# Altium schematic sheet 温控风扇原理图.SchDoc: 温控风扇原理图
size A4
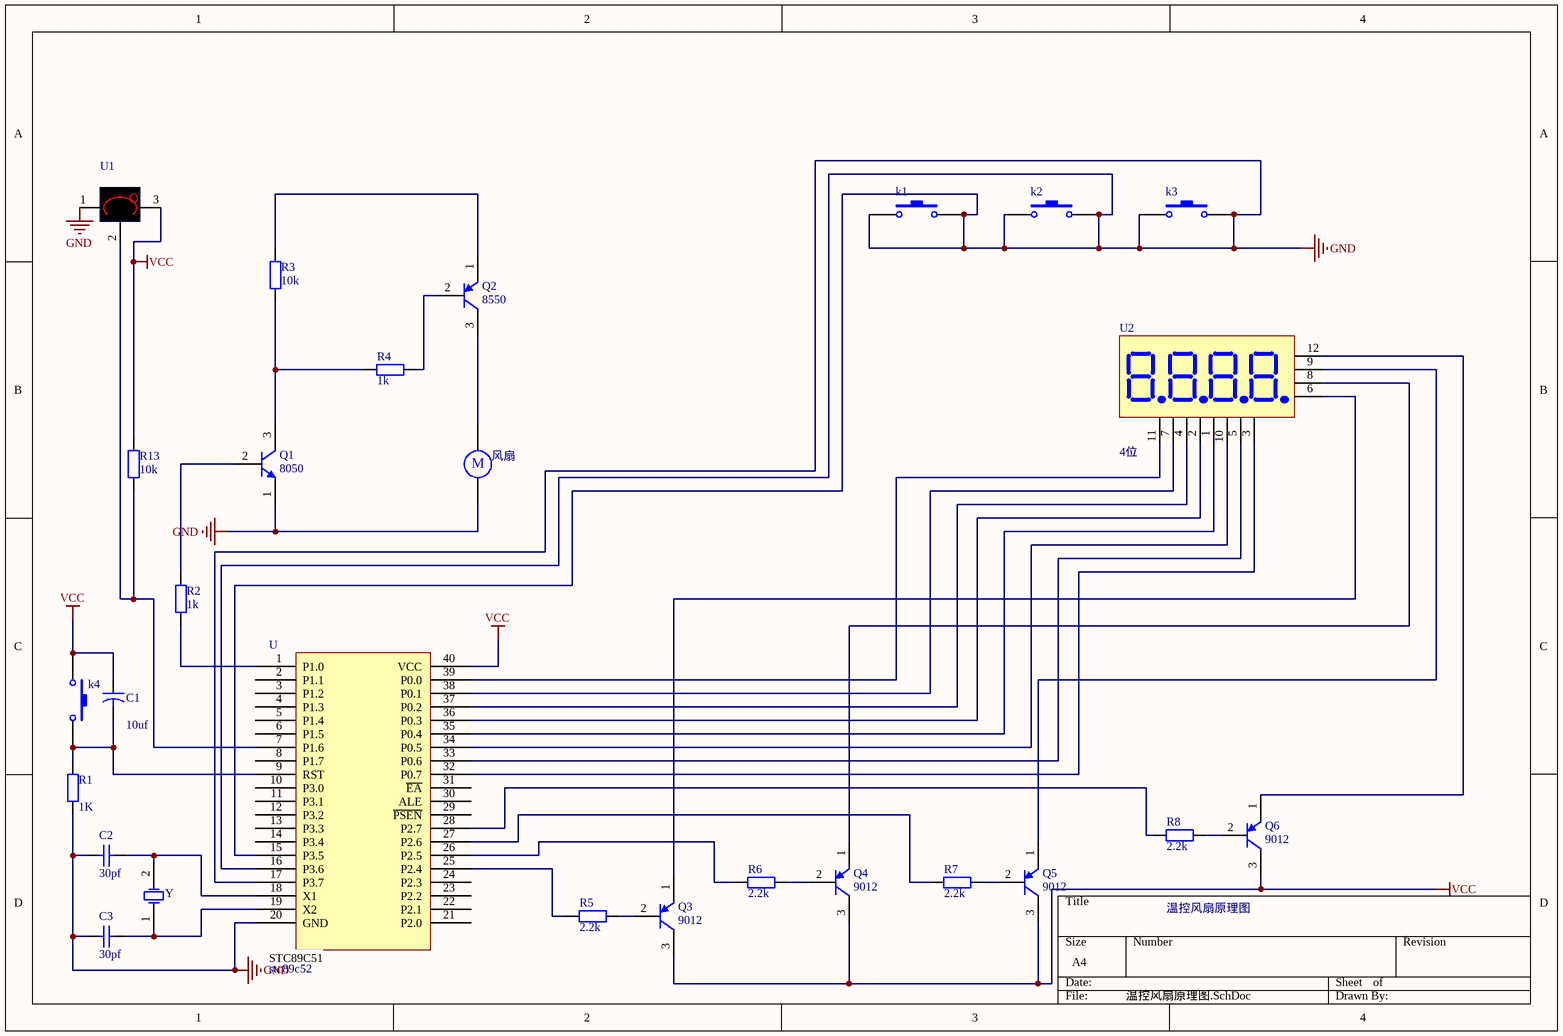
[diagram p0: 温控风扇原理图.SchDoc]

## Parts
C1  value 10uf  [CAPR5-4X5]  (hidden comment: Cap2)
C2  30pf  [1206_C]
C3  30pf  [1206_C]
k1  Tactile Switch  [BUTTON_6*6]  (value not drawn)
k2  Tactile Switch  [BUTTON_6*6]  (value not drawn)
k3  Tactile Switch  [BUTTON_6*6]  (value not drawn)
k4  Tactile Switch  [BUTTON_6*6]  (value not drawn)
Q1  8050  [TO-92(TO-92-3)]
Q2  8550  [TO-92(TO-92-3)]
Q3  9012  [TO-92(TO-92-3)]
Q4  9012  [TO-92(TO-92-3)]
Q5  9012  [TO-92(TO-92-3)]
Q6  9012  [TO-92(TO-92-3)]
R1  value 1K  [AXIAL-0.4]  (hidden comment: Res2)
R2  1k  [AXIAL-0.6-R]
R3  10k  [AXIAL-0.6-R]
R4  1k  [AXIAL-0.6-R]
R5  2.2k  [AXIAL-0.8-R]
R6  2.2k  [AXIAL-0.8-R]
R7  2.2k  [AXIAL-0.8-R]
R8  2.2k  [AXIAL-0.8-R]
R13  10k  [AXIAL-0.6-R]
U  stc89c52  [stc89c52]
U1  DSB18B20  [BCY-W3/E4]  (value not drawn)
U2  4位  [SEG4_3641]
Y  XTAL  [R38]  (value not drawn)
风扇  Motor  [RB5-10.5]  (value not drawn)

## Nets
GND: C2.1 C3.1 k1.1 k1.2 k2.1 k2.2 k3.1 k3.2 Q1.1(E) R1.1 U.15(P3.5) U.16(P3.6) U.17(P3.7) U.20(GND) U1.1(GND) 风扇.2
VCC: C1.1 k4.1 Q3.3(C) Q4.3(C) Q5.3(C) Q6.3(C) R13.2 U.40(VCC) U1.3(VDD)
NetC1_2: C1.2 k4.2 R1.2 U.9(RST)
NetC2_2: C2.2 U.18(X1) Y.2(OSC2)
NetC3_2: C3.2 U.19(X2) Y.1(OSC1)
NetQ1_2: Q1.2(B) R2.2
NetQ1_3: Q1.3(C) R3.1 R4.1
NetQ2_1: Q2.1(E) R3.2
NetQ2_2: Q2.2(B) R4.2
NetQ2_3: Q2.3(C) 风扇.1
NetQ3_1: Q3.1(E) U2.6(h1)
NetQ3_2: Q3.2(B) R5.2
NetQ4_1: Q4.1(E) U2.8(h2)
NetQ4_2: Q4.2(B) R6.2
NetQ5_1: Q5.1(E) U2.9(h3)
NetQ5_2: Q5.2(B) R7.2
NetQ6_1: Q6.1(E) U2.12(h4)
NetQ6_2: Q6.2(B) R8.2
NetR2_1: R2.1 U.1(P1.0)
NetR5_1: R5.1 U.25(P2.4)
NetR6_1: R6.1 U.26(P2.5)
NetR7_1: R7.1 U.27(P2.6)
NetR8_1: R8.1 U.28(P2.7)
NetR13_1: R13.1 U.7(P1.6) U1.2(DATA)
NetU_32: U.32(P0.7) U2.3(dp)
NetU_33: U.33(P0.6) U2.5(g)
NetU_34: U.34(P0.5) U2.10(f)
NetU_35: U.35(P0.4) U2.1(e)
NetU_36: U.36(P0.3) U2.2(d)
NetU_37: U.37(P0.2) U2.4(c)
NetU_38: U.38(P0.1) U2.7(b)
NetU_39: U.39(P0.0) U2.11(a)

Not connected (* = marked no-connect by the designer): U 2(P1.1) 3(P1.2) 4(P1.3) 5(P1.4) 6(P1.5) 8(P1.7) 10(P3.0) 11(P3.1) 12(P3.2) 13(P3.3) 14(P3.4) 21(P2.0) 22(P2.1) 23(P2.2) 24(P2.3) 29(~{PSEN}) 30(ALE) 31(~{EA})

## Notes on the sheet
- (in symbol Motor) M
- (in symbol stc89c52) STC89C51

## Library data of the parts
C1 = Cap2: Capacitor; Published: 23-Sep-2002; PackageReference: CAPR5-4X5; Publisher: Altium Limited; PackageDescription: Capacitor; 2 Leads
C2 C3 = Cap_1206: 1206贴片电容; Value: 104; Package: 1206; 常见贴片电容尺寸图: https://wenku.baidu.com/view/21d5206100f69e3143323968011ca300a6c3f6b2.html
k1-k4 = SW-PB: Tactile Switch触觉开关; Published: 24-Mar-1999; LatestRevisionDate: 17-Jul-2002; LatestRevisionNote: Re-released for DXP Platform.; PackageReference: SPST-2; Publisher: Altium Limited
Q1 = 8050_TO-92: NPN型小功率三极管; HelpURL: https://baike.baidu.com/item/%E4%B8%89%E6%9E%81%E7%AE%A18050/6704654?fr=aladdin
Q2 = 8550_TO-92: PNP型小功率三极管; HelpURL: https://baike.baidu.com/item/%E4%B8%89%E6%9E%81%E7%AE%A18550/862606
Q3-Q6 = 9012_TO-92: PNP型小功率三极管; datasheet: http://pdf1.alldatasheetcn.com/datasheet-pdf/view/311757/DAYA/9012.html
R1 = Res2: Resistor; Published: 8-Jun-2000; LatestRevisionDate: 17-Jul-2002; LatestRevisionNote: Re-released for DXP Platform.; PackageReference: AXIAL-0.4; Publisher: Altium Limited; PackageDescription: Axial Device, Thru-Hole; 2 Leads; 0.4 in Pin Spacing
R2-R4 R13 = Res2_1W: Resistor 直插电阻 1W; Published: 8-Jun-2000; LatestRevisionDate: 17-Jul-2002; LatestRevisionNote: Re-released for DXP Platform.; PackageReference: AXIAL-0.4; Publisher: Altium Limited
  R2 R4: Value: 1k
  R3 R13: Value: 10k
R5-R8 = Res2_2W: Resistor 直插电阻 2W; Published: 8-Jun-2000; LatestRevisionDate: 17-Jul-2002; LatestRevisionNote: Re-released for DXP Platform.; PackageReference: AXIAL-0.4; Publisher: Altium Limited; Value: 2.2k
U1 = DSB18B20: Temperature Sensor
U2 = 4位-共阳: 4位一体共阳数码管 0.36英寸30mm*14mm*7.2mm; HelpURL: https://detail.tmall.com/item.htm?id=13286121313&ali_refid=a3_430583_1006:1104520036:N:4%E4%BD%8D%E6%97%B6%E9%92%9F%E6%95%B0%E7%A0%81%E7%AE%A1:3646a0f2da44255190f9d12f1f7a258e&ali_trackid=1_3646a0f2da44255190f9d12f1f7a258e&spm=a230r.1.14.1.71e01f57Ca6Hpo
Y = XTAL: Crystal Oscillator; Published: 8-Jun-2000; LatestRevisionDate: 17-Jul-2002; LatestRevisionNote: Re-released for DXP Platform.; PackageReference: R38; Publisher: Altium Limited; PackageDescription: Crystal, Thru-Hole; 2 Leads; Body 3.1 x 8.2 mm (Dia.xH)
风扇 = Motor: Motor, General Kind; Published: 24-Mar-1999; LatestRevisionDate: 17-Jul-2002; LatestRevisionNote: Re-released for DXP Platform.; PackageReference: RB5-10.5; Publisher: Altium Limited; PackageDescription: Capacitor (Radial); 2 Leads